# Altium schematic sheet SensorInput.SchDoc
size A; SheetNumber: 8; SheetTotal: 11
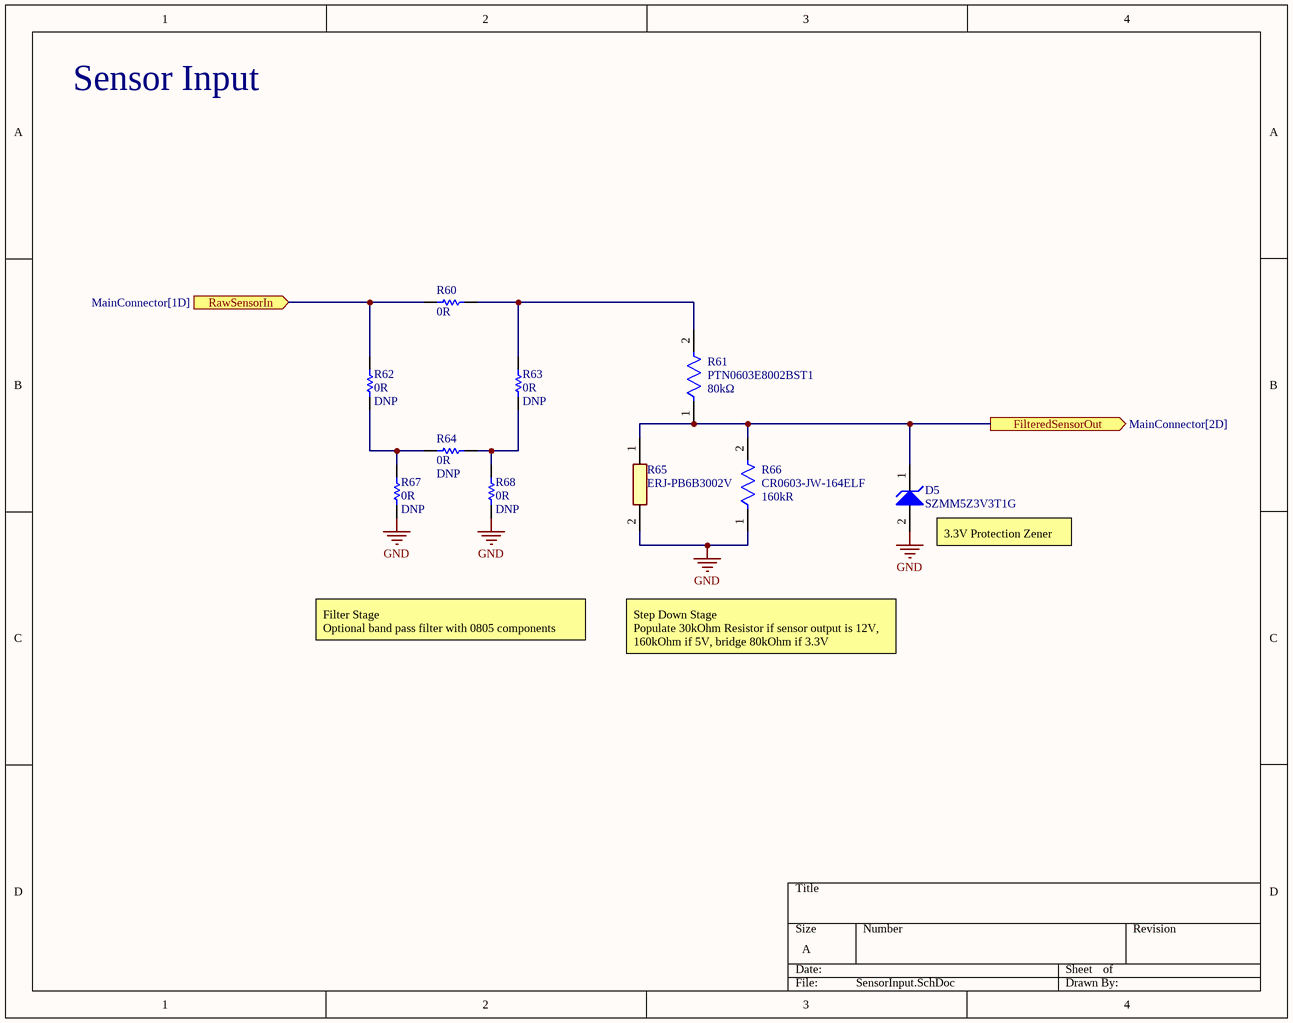
[diagram p0: SensorInput.SchDoc]

## Parts
D5  SZMM5Z3V3T1G  [ONSC-SOD-523-2-502-01_V]
R60  Resistance: 0R  [RESC2013X60X35LL10T20]  (hidden comment: RC0805JR-100RL)
R61  PTN0603E8002BST1  Resistance: 80kΩ  [FP-PTN0603-MFG]
R62  Resistance: 0R  [RESC2013X60X35LL10T20]  (hidden comment: RC0805JR-100RL)
R63  Resistance: 0R  [RESC2013X60X35LL10T20]  (hidden comment: RC0805JR-100RL)
R64  Resistance: 0R  [RESC2013X60X35LL10T20]  (hidden comment: RC0805JR-100RL)
R65  ERJ-PB6B3002V  [RESC2012X70N]
R66  CR0603-JW-164ELF  Resistance: 160kR  [FP-CR0603-IPC_B]
R67  Resistance: 0R  [RESC2013X60X35LL10T20]  (hidden comment: RC0805JR-100RL)
R68  Resistance: 0R  [RESC2013X60X35LL10T20]  (hidden comment: RC0805JR-100RL)

## Ports
FilteredSensorOut (out, see MainConnector[2D]), RawSensorIn (in, see MainConnector[1D])

## Nets
GND: D5.2(A) R65.2 R66.1 R67.2 R68.2
FilteredSensorOut: D5.1(K) R61.1 R65.1 R66.2 ; port FilteredSensorOut
RawSensorIn: R60.2 R62.2 ; port RawSensorIn
NetR60_1: R60.1 R61.2 R63.1
NetR62_1: R62.1 R64.2 R67.1
NetR63_2: R63.2 R64.1 R68.1

## Notes on the sheet
- Sensor Input
- (near D5) 3.3V Protection Zener
- Filter Stage
  Optional band pass filter with 0805 components
- Step Down Stage
  Populate 30kOhm Resistor if sensor output is 12V, 160kOhm if 5V, bridge 80kOhm if 3.3V

## Library data of the parts
D5 = CMP-1060-00751-1: Zener Voltage Regulator, 500 mW, 2-Pin SOD-523, Pb-Free, Tape and Reel; Manufacturer: On Semiconductor; VZ Typ (V): 3.3; P Max (W): 0.5; ComponentLink1URL: http://www.onsemi.com/; PackageReference: SOD-523-2-502-01; DatasheetVersion: Rev. 10; ComponentLink3Description: Package Specification; Packing: Tape and Reel; ComponentLink2Description: Datasheet; ComponentLink3URL: http://www.onsemi.com/pub_link/Collateral/502-01.PDF; PartNumber: SZMM5Z3V3T1G; Mounting Technology: Surface Mount; RoHS: Pb-Free; PackageVersion: Rev. E, 09/2010; ComponentLink1Description: Manufacturer URL; PackageDescription: 2-Pin SOD, Body 1.2 x 0.8 mm; ComponentLink2URL: http://www.onsemi.cn/pub_link/Collateral/MM5Z2V4T1-D.PDF
R60 R62-R64 R67 R68 = CMP-2000-06963-1: Chip Resistor, 0 Ohm, +/- 5%, 125 mW, -55 to 155 degC, 0805 (2012 Metric), RoHS, Tape and Reel; Manufacturer: Yageo; Product Length (mm): 2mm; Tolerance (+ or -): NotRequired; Case Style: Molded; Product Height (mm): 0.5mm; Power Rating(s): NotRequiredW; Product Depth (mm): 1.25mm; Mounting Technology: SurfaceMount; Military Standard: NotRequired; Operating Temp Range: -55Cto155C; Temperature Coefficient: NotRequired; Package Description: 2-Pin Surface Mounted Device, Body 2 x 1.25 mm; Datasheet Version: Rev. 7, 05/2017; Failure Rate: NotRequired; Manufacturer URL: http://www.yageo.com/; Datasheet URL: http://www.yageo.com/documents/recent/PYu-RC_Group_51_RoHS_L_7.pdf; Packaging: TapeandReel; Package Reference: 0805; Package / Case: 0805; Termination Style: NotRequired; Type: ThickFilm; Construction: Rectangular
  R62-R64 R67 R68: DNP: DNP
R61 = CMP-02407-000009-1: RES 80K OHM 0.1% 0.15W 0603; Manufacturer: Vishay; Value: 80kΩ; Voltage Rating: 75V; Temperature Coefficient: 25ppm/°C; Power Rating: 150mW; Device Class L1: Passive Components; Device Class L2: Resistors; Footprint Url: https://www.vishay.com/docs/60119/landpatterns.pdf; RoHS: TRUE; Lead Free: Yes; Category: Res; Automotive: No; Tolerance: 0.1%; ComponentLink2URL: https://www.vishay.com/docs/60026/ptn.pdf; Device Class L3: Chip SMD Resistors; Series: PTN; Octopart: https://octopart.com/ptn0603e8002bst1-vishay-44224719; Height: 0.02inch; Composition: Thin Film; Digikey Description: RES 80K OHM 0.1% 0.15W 0603; Temperature Range Low: -55°C; Temperature Range High: +155°C; Manufacturer Part Number: PTN0603E8002BST1; ComponentLink2Description: Datasheet; Ipc Land Pattern Name: RESC16381X51; Package: PTN0603; Temperature: -55°C to +155°C
R65 = ERJ-PB6B3002V: Resistor; Manufacturer_Name: Panasonic; Datasheet Link: https://componentsearchengine.com/Datasheets/1/ERJ-PB6B3002V.pdf; Height: 0.7mm; Manufacturer_Part_Number: ERJ-PB6B3002V; Mouser Part Number: 667-ERJ-PB6B3002V; Mouser Price/Stock: https://www.mouser.co.uk/ProductDetail/Panasonic/ERJ-PB6B3002V?qs=eFOtW6xYNWHxFAxx7HWdpg%3D%3D; Arrow Part Number: ERJ-PB6B3002V; Arrow Price/Stock: https://www.arrow.com/en/products/erj-pb6b3002v/panasonic?region=nac
R66 = CMP-07231-004905-1: Thick Film Chip Resistors 0603 160kΩ 0.1W 5% 200ppm/°C; Max Power Dissipation: 100mW; Voltage Rating: 50V; Features: Moisture Resistant; Military Standard: Not; Tolerance: 5%; Width: 0.8mm; Radiation Hardening: No; Max Operating Temperature: 155°C; Case Code (Imperial): 0603; Number of Terminations: 2; Packaging: Tape and Reel; Depth: 0.8mm; Package Quantity: 5000; Contact Plating: Tin; Case/Package: 0603; Height: 0.022inch; Case Code (Metric): 1608; Thickness: 457um; Min Operating Temperature: -55°C; Termination: SMD/SMT; Mount: Surface Mount; Length: 1.6mm; Composition: Thick Film; Temperature Coefficient: 200ppm/°C; Power Rating: 100mW; DNP: DNP